# Altium schematic sheet BC35_module.SchDoc
size A3
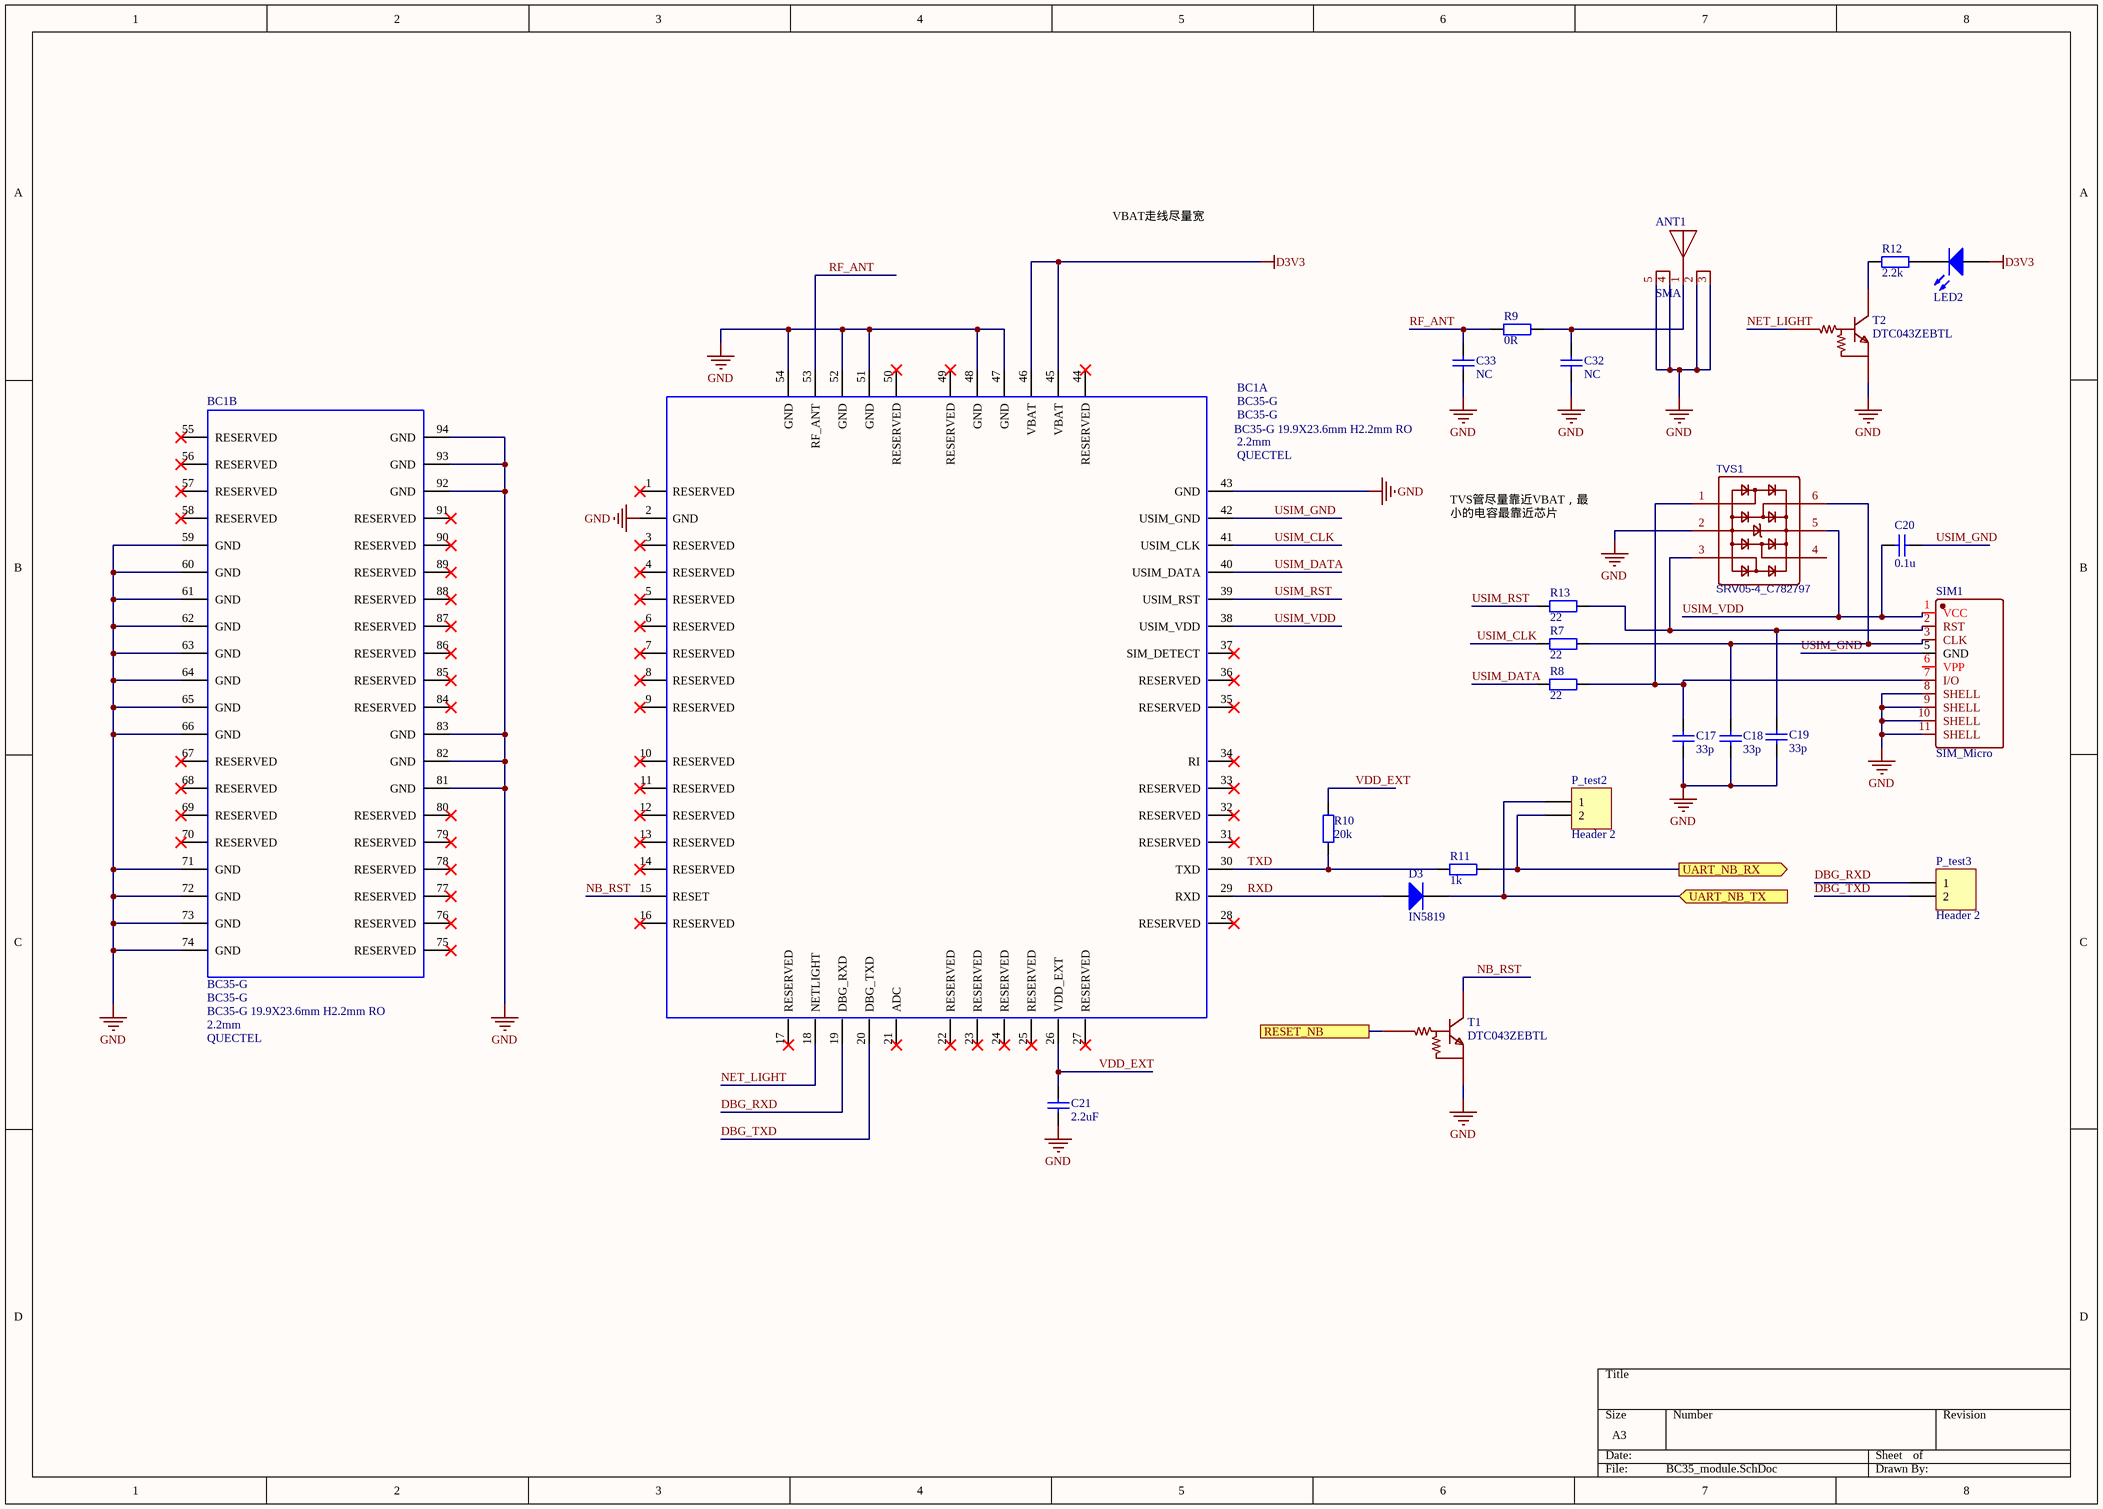
[diagram p0: BC35_module.SchDoc]

## Parts
ANT1  SMA  [ANT-TH_DOSIN-806-0003]
BC1  BC35-G  Part Description: BC35-G 19.9X23.6mm H2.2mm RO  Geometry.Height: 2.2mm  Manufacturer: QUECTEL  [BC35-G]  (parts A,B of 2)
C17  33p  [1206_C]
C18  33p  [1206_C]
C19  33p  [1206_C]
C20  0.1u  [1206_C]
C21  2.2uF  [1206_C]
C32  NC  [1206_C]
C33  NC  [1206_C]
D3  IN5819  [SOD-323]
LED2  LED Chip  [CLED2012-0805]  (value not drawn)
P_test2  Header 2  [XH254-2]
P_test3  Header 2  [XH254-2]
R7  22  [0805_R]
R8  22  [0805_R]
R9  0R  [0805_R]
R10  20k  [0805_R]
R11  1k  [0805_R]
R12  2.2k  [0805_R]
R13  22  [0805_R]
SIM1  SIM_Micro  [SIM-SMD_SIM-002-P6]
T1  DTC043ZEBTL  [SOT-416_L1.6-W0.8-P1.00-LS1.6-BR]
T2  DTC043ZEBTL  [SOT-416_L1.6-W0.8-P1.00-LS1.6-BR]
TVS1  SRV05-4_C782797  [SOT-23-6_L2.9-W1.6-P0.95-LS2.8-BR]

## Ports
RESET_NB, UART_NB_RX (out), UART_NB_TX (in)

## Nets
D3V3: BC1.45(VBAT) BC1.46(VBAT) LED2.1(A)
GND: ANT1.2 ANT1.3 ANT1.4 ANT1.5 BC1.2(GND) BC1.43(GND) BC1.47(GND) BC1.48(GND) BC1.51(GND) BC1.52(GND) BC1.54(GND) BC1.59(GND) BC1.60(GND) BC1.61(GND) BC1.62(GND) BC1.63(GND) BC1.64(GND) BC1.65(GND) BC1.66(GND) BC1.71(GND) BC1.72(GND) BC1.73(GND) BC1.74(GND) BC1.81(GND) BC1.82(GND) BC1.83(GND) BC1.92(GND) BC1.93(GND) BC1.94(GND) C17.1 C18.1 C19.1 C21.1 C32.1 C33.1 SIM1.8(SHELL) SIM1.9(SHELL) SIM1.10(SHELL) SIM1.11(SHELL) T1.2(E) T2.2(E) TVS1.2
DBG_RXD: BC1.19(DBG_RXD) P_test3.1
DBG_TXD: BC1.20(DBG_TXD) P_test3.2
NB_RST: BC1.15(RESET) T1.3(C)
NET_LIGHT: BC1.18(NETLIGHT) T2.1(B)
RESET_NB: T1.1(B) ; port RESET_NB
RF_ANT: BC1.53(RF_ANT) C33.2 R9.2
RXD: BC1.29(RXD) D3.1(A)
TXD: BC1.30(TXD) R10.2 R11.2
UART_NB_RX: P_test2.2 R11.1 ; port UART_NB_RX
UART_NB_TX: D3.2(K) P_test2.1 ; port UART_NB_TX
USIM_CLK: BC1.41(USIM_CLK) R7.2
USIM_DATA: BC1.40(USIM_DATA) R8.2
USIM_GND: BC1.42(USIM_GND) C20.1 SIM1.5(GND)
USIM_RST: BC1.39(USIM_RST) R13.2
USIM_VDD: BC1.38(USIM_VDD) C20.2 SIM1.1(VCC) TVS1.5
VDD_EXT: BC1.26(VDD_EXT) C21.2 R10.1
NetANT1_1: ANT1.1 C32.2 R9.1
NetC17_2: C17.2 R8.1 SIM1.7(I/O) TVS1.1
NetC18_2: C18.2 R7.1 SIM1.3(CLK) TVS1.6
NetC19_2: C19.2 R13.1 SIM1.2(RST) TVS1.3
NetLED2_2: LED2.2(K) R12.1
NetR12_2: R12.2 T2.3(C)

Not connected (* = marked no-connect by the designer): BC1 1(RESERVED)* 3(RESERVED)* 4(RESERVED)* 5(RESERVED)* 6(RESERVED)* 7(RESERVED)* 8(RESERVED)* 9(RESERVED)* 10(RESERVED)* 11(RESERVED)* 12(RESERVED)* 13(RESERVED)* 14(RESERVED)* 16(RESERVED)* 17(RESERVED)* 21(ADC)* 22(RESERVED)* 23(RESERVED)* 24(RESERVED)* 25(RESERVED)* 27(RESERVED)* 28(RESERVED)* 31(RESERVED)* 32(RESERVED)* 33(RESERVED)* 34(RI)* 35(RESERVED)* 36(RESERVED)* 37(SIM_DETECT)* 44(RESERVED)* 49(RESERVED)* 50(RESERVED)* 55(RESERVED)* 56(RESERVED)* 57(RESERVED)* 58(RESERVED)* 67(RESERVED)* 68(RESERVED)* 69(RESERVED)* 70(RESERVED)* 75(RESERVED)* 76(RESERVED)* 77(RESERVED)* 78(RESERVED)* 79(RESERVED)* 80(RESERVED)* 84(RESERVED)* 85(RESERVED)* 86(RESERVED)* 87(RESERVED)* 88(RESERVED)* 89(RESERVED)* 90(RESERVED)* 91(RESERVED)*; SIM1 6(VPP); TVS1 4

## Notes on the sheet
- VBAT走线尽量宽
- TVS管尽量靠近VBAT，最小的电容最靠近芯片

## Library data of the parts
C17-C21 C32 C33 = Cap_1206: 1206贴片电容; Value: 104; Package: 0805; 常见贴片电容尺寸图: https://wenku.baidu.com/view/21d5206100f69e3143323968011ca300a6c3f6b2.html
D3 = 1N4148WS_SOD-323: 二极管; ComponentLink1Description: 供应商链接; ComponentLink1URL: http://www.szlcsc.com/product/details_2485.html; Package: SOD-323; Supplier: LC; SuppliersPartNumber: C2128
LED2 = LED Chip: Typical Chip LED; Published: 8-Jun-2000; Revision: July-2002: Re-released for DXP Platform.; Publisher: Altium Limited
P_test2 P_test3 = Header 2: Header, 2-Pin; LatestRevisionDate: 17-Jul-2002; LatestRevisionNote: Re-released for DXP Platform.; Publisher: Altium Limited
R7-R13 = Res_0805: 0805贴片电阻; ComponentLink1Description: 供应商链接; ComponentLink1URL: http://www.szlcsc.com/product/details_26856.html; Package: 0805; Supplier: LC; SuppliersPartNumber: C26113
TVS1 = SRV05-4_C782797: BOM_Manufacturer: SEMBO; Contributor: LCSC; BOM_Supplier: LCSC; BOM_Supplier Part: C782797; BOM_Manufacturer Part: SRV05-4; spicePre: D; spiceSymbolName: SRV05-4_C782797
BC1 = BC35-G: Value: BC35-G